# EAGLE schematic Sch1 (EAGLE 7.6.0)
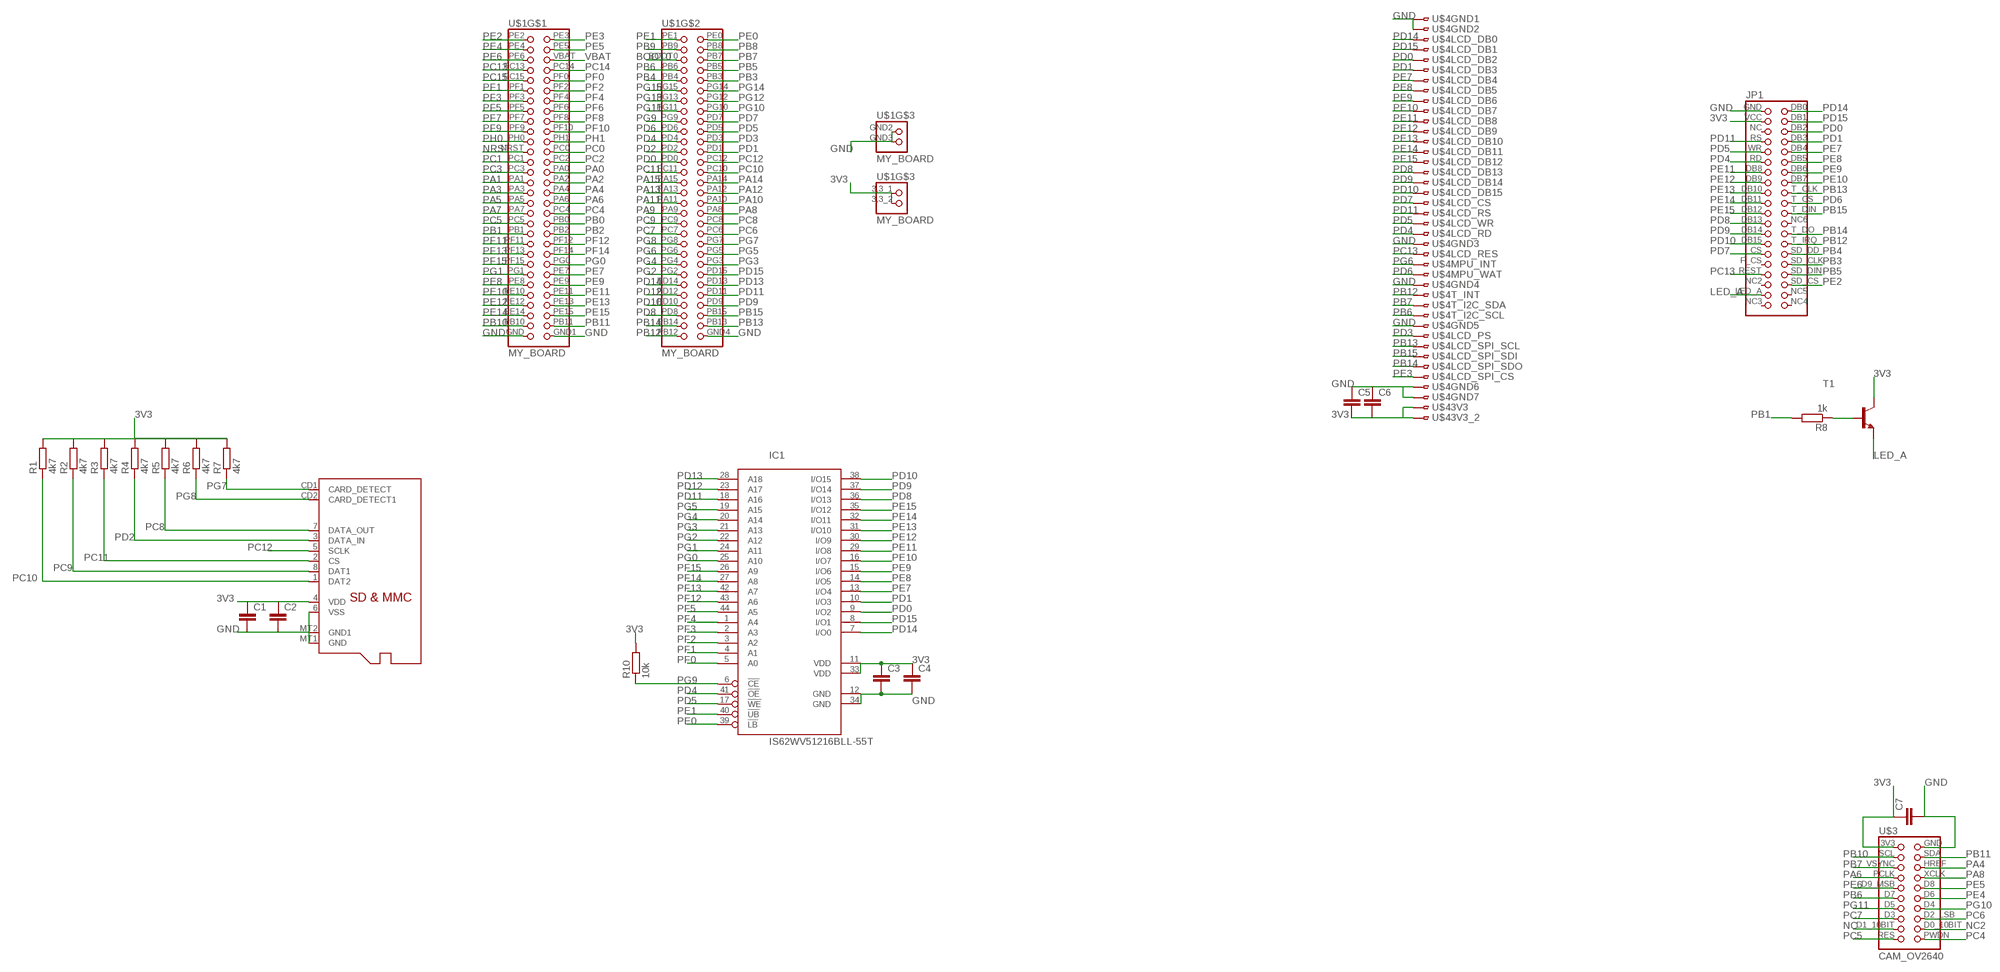
[diagram p0: schematic, sheet 1]

## Parts
C1  C-EUC1206  [C1206]
C2  C-EUC1206  [C1206]
C3  C-EUC1206  [C1206]
C4  C-EUC1206  [C1206]
C5  C-EUC1206  [C1206]
C6  C-EUC1206  [C1206]
C7  C-EUC1206  [C1206]
IC1  IS62WV51216BLL-55T  [TSOP-II-44]
JP1  LCD320QVBLCD320QVB  [2X20]
R1  4k7  R-EU_0204/7  [0204/7]
R2  4k7  R-EU_0204/7  [0204/7]
R3  4k7  R-EU_0204/7  [0204/7]
R4  4k7  R-EU_0204/7  [0204/7]
R5  4k7  R-EU_0204/7  [0204/7]
R6  4k7  R-EU_0204/7  [0204/7]
R7  4k7  R-EU_0204/7  [0204/7]
R8  1k  R-EU_0204/5  [0204/5]
R10  10k  R-EU_0204/7  [0204/7]
T1  BC337-NPN-TO92-CBE  [TO92-CBE]
U$1  MY_BOARD  [MY_BOARD]
U$3  CAM_OV2640  [CAM_OV2640]
U$4  LCD800TFT  [FH12-40S-0.5SH]
U$5  MICROSD  [MICROSD]

## Nets
3V3: C1.1 C2.1 C3.1 C4.1 C5.2 C6.2 C7.1 IC1.11(VDD) IC1.33(VDD) JP1.VCC R1.2 R2.2 R3.2 R4.2 R5.2 R6.2 R7.2 R10.2 T1.C U$1.3,3_1 U$1.3,3_2 U$3.3V3 U$4.39 U$4.40 U$5.4(VDD)
BOOT0: U$1.BOOT0
GND: C1.2 C2.2 C3.2 C4.2 C5.1 C6.1 C7.2 IC1.12(GND) IC1.34(GND) JP1.GND U$1.GND U$1.GND1 U$1.GND2 U$1.GND3 U$1.GND4 U$3.GND U$4.1 U$4.2 U$4.23 U$4.27 U$4.31 U$4.37 U$4.38 U$5.6(VSS) U$5.MT1(GND) U$5.MT2(GND1)
LED_A: JP1.LED_A T1.E
N$9: R8.1 T1.B
NC: U$3.D1_10BIT
NC2: U$3.D0_10BIT
NRST: U$1.NRST
PA0: U$1.PA0
PA1: U$1.PA1
PA2: U$1.PA2
PA3: U$1.PA3
PA4: U$1.PA4 U$3.HREF
PA5: U$1.PA5
PA6: U$1.PA6 U$3.PCLK
PA7: U$1.PA7
PA8: U$1.PA8 U$3.XCLK
PA9: U$1.PA9
PA10: U$1.PA10
PA11: U$1.PA11
PA12: U$1.PA12
PA13: U$1.PA13
PA14: U$1.PA14
PA15: U$1.PA15
PB0: U$1.PB0
PB1: R8.2 U$1.PB1
PB2: U$1.PB2
PB3: JP1.SD_CLK U$1.PB3
PB4: JP1.SD_DD U$1.PB4
PB5: JP1.SD_DIN U$1.PB5
PB6: U$1.PB6 U$3.D7 U$4.30
PB7: U$1.PB7 U$3.VSYNC U$4.29
PB8: U$1.PB8
PB9: U$1.PB9
PB10: U$1.PB10 U$3.SCL
PB11: U$1.PB11 U$3.SDA
PB12: JP1.T_IRQ U$1.PB12 U$4.28
PB13: JP1.T_CLK U$1.PB13 U$4.33
PB14: JP1.T_DO U$1.PB14 U$4.35
PB15: JP1.T_DIN U$1.PB15 U$4.34
PC0: U$1.PC0
PC1: U$1.PC1
PC2: U$1.PC2
PC3: U$1.PC3
PC4: U$1.PC4 U$3.PWDN
PC5: U$1.PC5 U$3.RES
PC6: U$1.PC6 U$3.D2_LSB
PC7: U$1.PC7 U$3.D3
PC8: R5.1 U$1.PC8 U$5.7(DATA_OUT)
PC9: R2.1 U$1.PC9 U$5.8(DAT1)
PC10: R1.1 U$1.PC10 U$5.1(DAT2)
PC11: R3.1 U$1.PC11 U$5.2(CS)
PC12: U$1.PC12 U$5.5(SCLK)
PC13: JP1.REST U$1.PC13 U$4.24
PC14: U$1.PC14
PC15: U$1.PC15
PD0: IC1.9(I/O2) JP1.DB2 U$1.PD0 U$4.5
PD1: IC1.10(I/O3) JP1.DB3 U$1.PD1 U$4.6
PD2: R4.1 U$1.PD2 U$5.3(DATA_IN)
PD3: U$1.PD3 U$4.32
PD4: IC1.41(!OE) JP1.RD U$1.PD4 U$4.22
PD5: IC1.17(!WE) JP1.WR U$1.PD5 U$4.21
PD6: JP1.T_CS U$1.PD6 U$4.26
PD7: JP1.CS U$1.PD7 U$4.19
PD8: IC1.36(I/O13) JP1.DB13 U$1.PD8 U$4.16
PD9: IC1.37(I/O14) JP1.DB14 U$1.PD9 U$4.17
PD10: IC1.38(I/O15) JP1.DB15 U$1.PD10 U$4.18
PD11: IC1.18(A16) JP1.RS U$1.PD11 U$4.20
PD12: IC1.23(A17) U$1.PD12
PD13: IC1.28(A18) U$1.PD13
PD14: IC1.7(I/O0) JP1.DB0 U$1.PD14 U$4.3
PD15: IC1.8(I/O1) JP1.DB1 U$1.PD15 U$4.4
PE0: IC1.39(!LB) U$1.PE0
PE1: IC1.40(!UB) U$1.PE1
PE2: JP1.SD_CS U$1.PE2
PE3: U$1.PE3 U$4.36
PE4: U$1.PE4 U$3.D6
PE5: U$1.PE5 U$3.D8
PE6: U$1.PE6 U$3.D9_MSB
PE7: IC1.13(I/O4) JP1.DB4 U$1.PE7 U$4.7
PE8: IC1.14(I/O5) JP1.DB5 U$1.PE8 U$4.8
PE9: IC1.15(I/O6) JP1.DB6 U$1.PE9 U$4.9
PE10: IC1.16(I/O7) JP1.DB7 U$1.PE10 U$4.10
PE11: IC1.29(I/O8) JP1.DB8 U$1.PE11 U$4.11
PE12: IC1.30(I/O9) JP1.DB9 U$1.PE12 U$4.12
PE13: IC1.31(I/O10) JP1.DB10 U$1.PE13 U$4.13
PE14: IC1.32(I/O11) JP1.DB11 U$1.PE14 U$4.14
PE15: IC1.35(I/O12) JP1.DB12 U$1.PE15 U$4.15
PF0: IC1.5(A0) U$1.PF0
PF1: IC1.4(A1) U$1.PF1
PF2: IC1.3(A2) U$1.PF2
PF3: IC1.2(A3) U$1.PF3
PF4: IC1.1(A4) U$1.PF4
PF5: IC1.44(A5) U$1.PF5
PF6: U$1.PF6
PF7: U$1.PF7
PF8: U$1.PF8
PF9: U$1.PF9
PF10: U$1.PF10
PF11: U$1.PF11
PF12: IC1.43(A6) U$1.PF12
PF13: IC1.42(A7) U$1.PF13
PF14: IC1.27(A8) U$1.PF14
PF15: IC1.26(A9) U$1.PF15
PG0: IC1.25(A10) U$1.PG0
PG1: IC1.24(A11) U$1.PG1
PG2: IC1.22(A12) U$1.PG2
PG3: IC1.21(A13) U$1.PG3
PG4: IC1.20(A14) U$1.PG4
PG5: IC1.19(A15) U$1.PG5
PG6: U$1.PG6 U$4.25
PG7: R7.1 U$1.PG7 U$5.CD1(CARD_DETECT)
PG8: R6.1 U$1.PG8 U$5.CD2(CARD_DETECT1)
PG9: IC1.6(!CE) R10.1 U$1.PG9
PG10: U$1.PG10 U$3.D4
PG11: U$1.PG11 U$3.D5
PG12: U$1.PG12
PG13: U$1.PG13
PG14: U$1.PG14
PG15: U$1.PG15
PH0: U$1.PH0
PH1: U$1.PH1
VBAT: U$1.VBAT
Unconnected: JP1.F_CS JP1.NC JP1.NC2 JP1.NC3 JP1.NC4 JP1.NC5 JP1.NC6

## Library data of the parts
C1-C7 = resistor:C-EU: CAPACITOR, European symbol
IC1 = memory-issi-asynsram:IS62WV51216BLL-*: 512k x 16 low voltage, ultra low power CMOS static RAM 55ns access time 3.6V power supply
JP1 = Stworzone:LCD320QVB: LCD320 QVB
R1-R7 R10 = resistor:R-EU_: RESISTOR, European symbol
R8 = rcl:R-EU_: RESISTOR, European symbol
T1 = transistor:*-NPN-: NPN Transistror BF959 corrected 2008.03.06
U$1 = Stworzone:MY_BOARD
U$3 = Stworzone:CAM_OV2640
U$4 = Stworzone:LCD800TFT
U$5 = adafruit:MICROSD: Micro-SD / Transflash card holder with SPI pinout For the 3M # 2908-05WB-MG and/or 4UCON #19656 push-push type